# EAGLE design Hermès Phi - Carte BBB v2 (EAGLE 6.3)
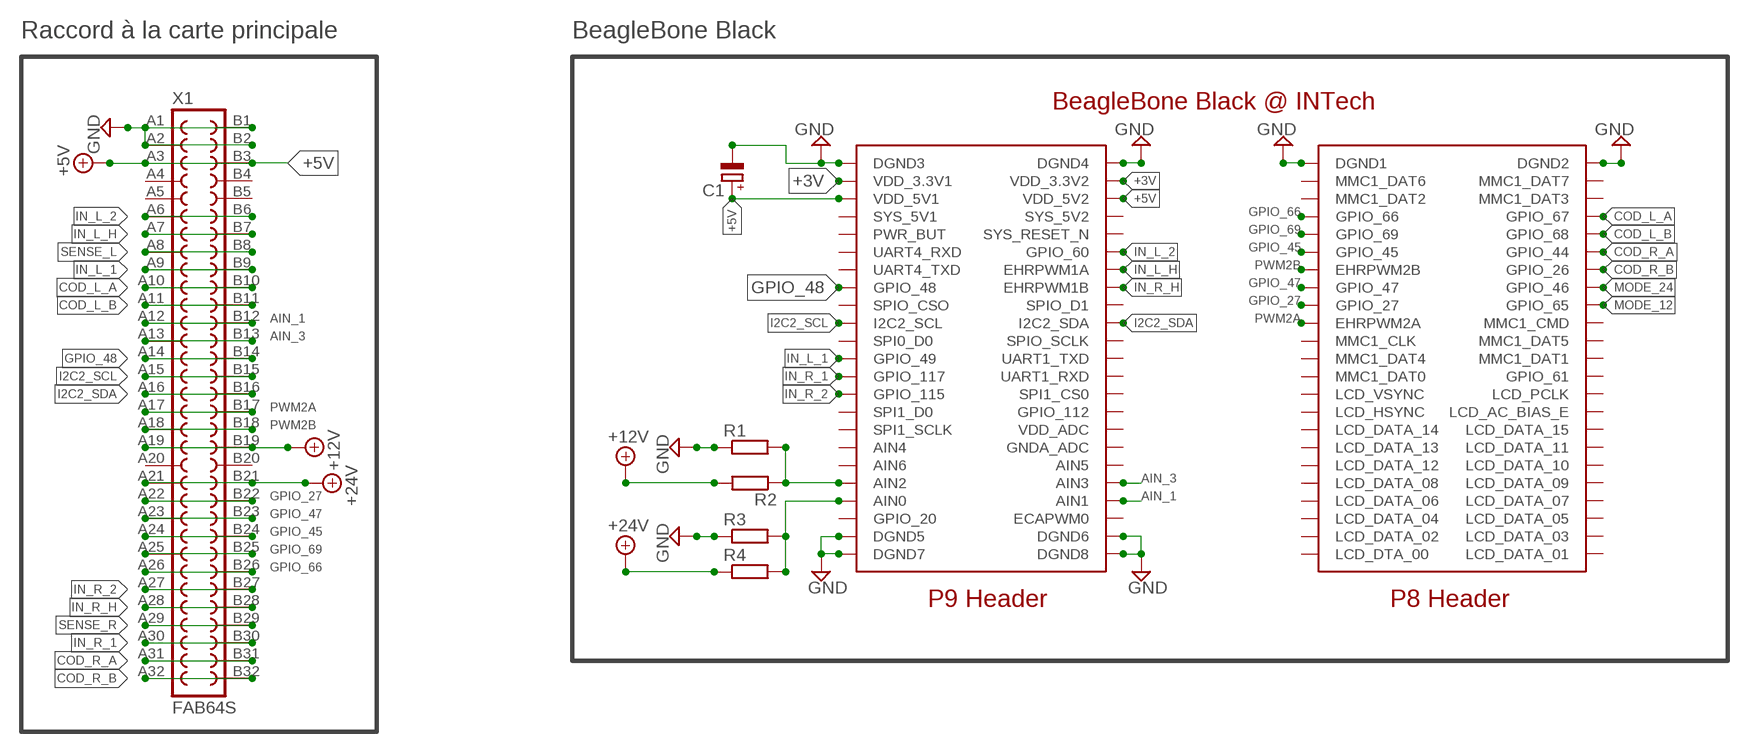
[diagram p0: schematic, sheet 1]

## Parts
C1  CPOL-EUE2.5-5  [E2,5-5]
R1  R-EU_0204/7  [0204/7]
R2  R-EU_0204/7  [0204/7]
R3  R-EU_0204/7  [0204/7]
R4  R-EU_0204/7  [0204/7]
U$1  BBB  [BBB]
X1  FAB64S  [FAB64S]

## Nets
+3V: U$1.VDD_3.3V1 U$1.VDD_3.3V2
+5V: C1.+ U$1.VDD_5V1 U$1.VDD_5V2 X1.A3 X1.B3
+12V: R2.2 X1.A19 X1.B19
+24V: R4.1 X1.A21 X1.B21
AIN_1: U$1.AIN1 X1.A12 X1.B12
AIN_3: U$1.AIN3 X1.A13 X1.B13
COD_L_A: U$1.GPIO_67 X1.A10 X1.B10
COD_L_B: U$1.GPIO_68 X1.A11 X1.B11
COD_R_A: U$1.GPIO_44 X1.A31 X1.B31
COD_R_B: U$1.GPIO_26 X1.A32 X1.B32
GND: C1.- R1.1 R3.1 U$1.DGND1 U$1.DGND2 U$1.DGND3 U$1.DGND4 U$1.DGND5 U$1.DGND6 U$1.DGND7 U$1.DGND8 X1.A1 X1.A2 X1.B1 X1.B2
GPIO_27: U$1.GPIO_27 X1.A22 X1.B22
GPIO_45: U$1.GPIO_45 X1.A24 X1.B24
GPIO_47: U$1.GPIO_47 X1.A23 X1.B23
GPIO_48: U$1.GPIO_48 X1.A14 X1.B14
GPIO_66: U$1.GPIO_66 X1.A26 X1.B26
GPIO_69: U$1.GPIO_69 X1.A25 X1.B25
I2C2_SCL: U$1.I2C2_SCL X1.A15 X1.B15
I2C2_SDA: U$1.I2C_SDA(I2C2_SDA) X1.A16 X1.B16
IN_L_1: U$1.GPIO_49 X1.A9 X1.B9
IN_L_2: U$1.GPIO_60 X1.A6 X1.B6
IN_L_H: U$1.EHRPWM1A X1.A7 X1.B7
IN_R_1: U$1.GPIO_117 X1.A30 X1.B30
IN_R_2: U$1.GPIO_115 X1.A27 X1.B27
IN_R_H: U$1.EHRPWM1B X1.A28 X1.B28
MODE_12: U$1.GPIO_65
MODE_24: U$1.GPIO_46
N$31: R3.2 R4.2 U$1.AIN0
N$32: R1.2 R2.1 U$1.AIN2
PWM2A: U$1.EHRPWM2A X1.A17 X1.B17
PWM2B: U$1.EHRPWMB2(EHRPWM2B) X1.A18 X1.B18
SENSE_L: X1.A8 X1.B8
SENSE_R: X1.A29 X1.B29
Unconnected: U$1.AIN4 U$1.AIN5 U$1.AIN6 U$1.ECAPWM0 U$1.GND_ADC(GNDA_ADC) U$1.GPIO_20 U$1.GPIO_61 U$1.GPIO_112 U$1.LCD_AC_BIAS(LCD_AC_BIAS_E) U$1.LCD_DATA_0(LCD_DTA_00) U$1.LCD_DATA_01 U$1.LCD_DATA_02 U$1.LCD_DATA_04 U$1.LCD_DATA_05 U$1.LCD_DATA_06 U$1.LCD_DATA_07 U$1.LCD_DATA_08 U$1.LCD_DATA_09 U$1.LCD_DATA_10 U$1.LCD_DATA_11 U$1.LCD_DATA_12 U$1.LCD_DATA_13 U$1.LCD_DATA_14 U$1.LCD_DATA_15 U$1.LCD_DTA_03(LCD_DATA_03) U$1.LCD_HSYNC U$1.LCD_PCLK U$1.LCD_VSYNC U$1.MMC1_CLK U$1.MMC1_CMD U$1.MMC1_DAT0 U$1.MMC1_DAT1 U$1.MMC1_DAT2 U$1.MMC1_DAT3 U$1.MMC1_DAT4 U$1.MMC1_DAT5 U$1.MMC1_DAT6 U$1.MMC1_DAT7 U$1.PWR_BUT U$1.SPI1_DO(SPI0_D0) U$1.SPI1_SCLK U$1.SPI1_SCO(SPI1_CS0) U$1.SPIO_CSO U$1.SPIO_D0(SPI1_D0) U$1.SPIO_D1 U$1.SPIO_SCLK U$1.SYS_5V1 U$1.SYS_5V2 U$1.SYS_RESET(SYS_RESET_N) U$1.UART1_RXD U$1.UART1_TXD U$1.UART4_RXD U$1.UART4_TXD U$1.VDD_ADC X1.A4 X1.A5 X1.A20 X1.B4 X1.B5 X1.B20

## Notes on the sheet
- Raccord à la carte principale | BeagleBone Black

## Library data of the parts
C1 = resistor:CPOL-EU: POLARIZED CAPACITOR, European symbol
R1-R4 = resistor:R-EU_: RESISTOR, European symbol
U$1 = BeagleBoneBlack:BBB: BeagleBone Black
X1 = con-vg:FAB64S: CONNECTOR female, 64 pins, block, type B, rows AB, grid 2.54 mm

## Board
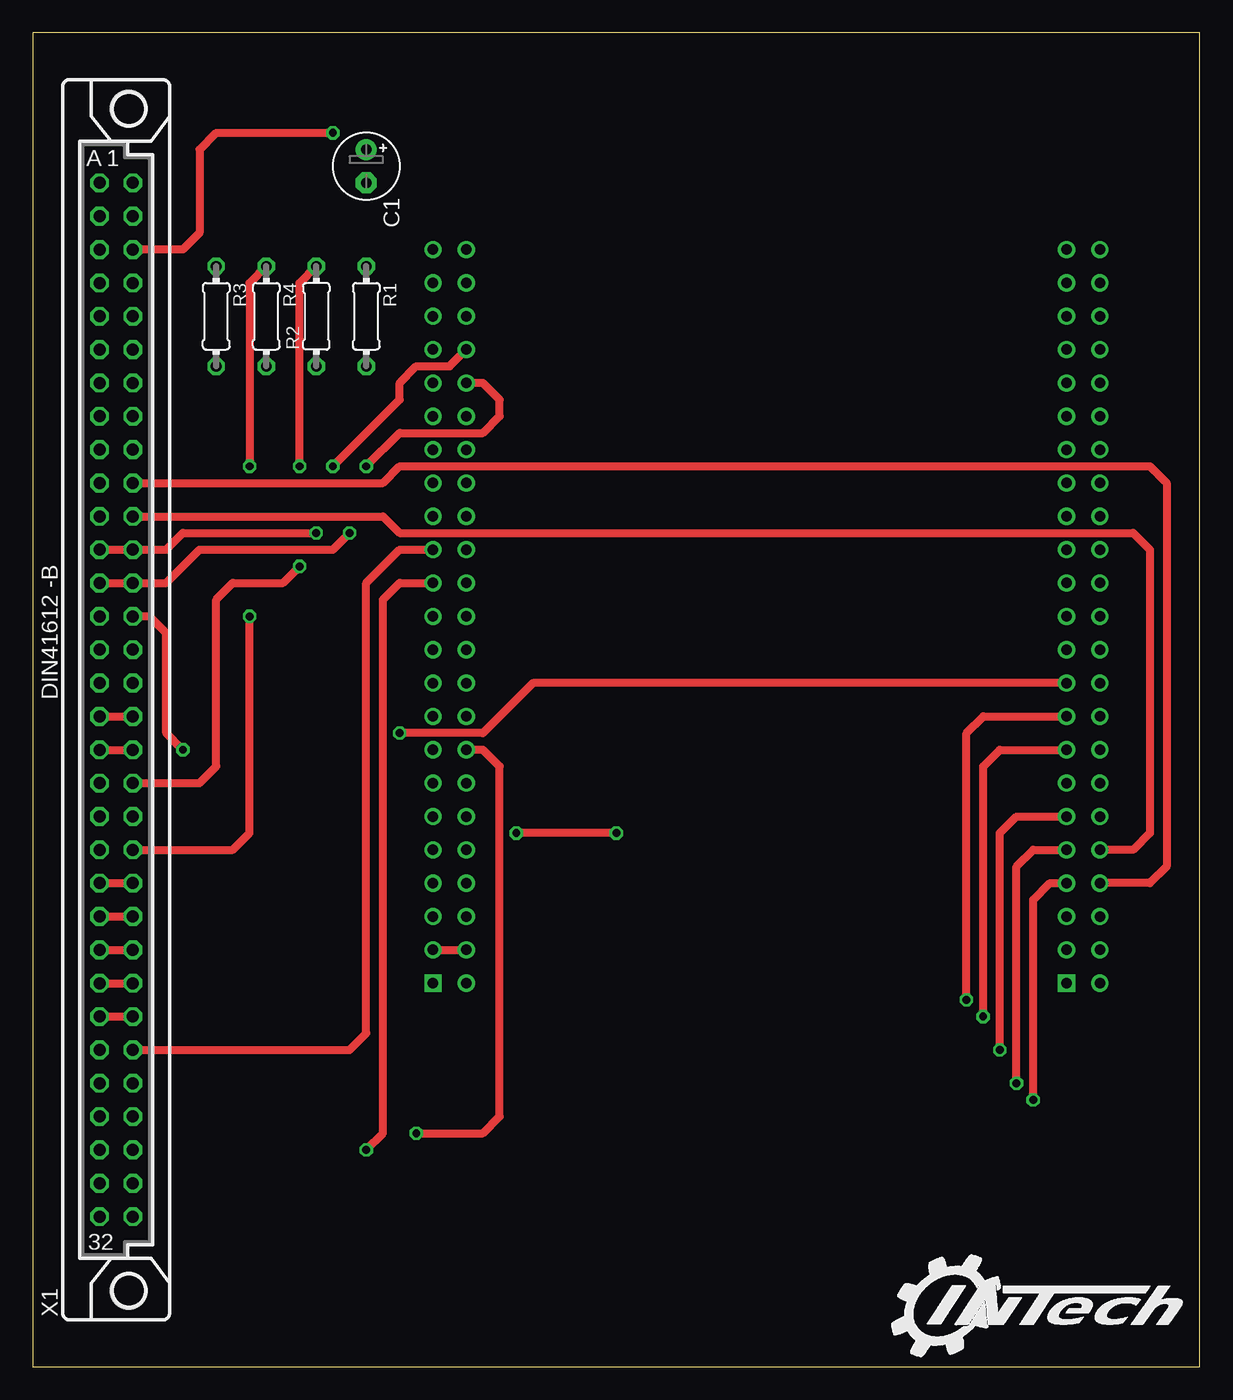
[diagram p1: board, top side]
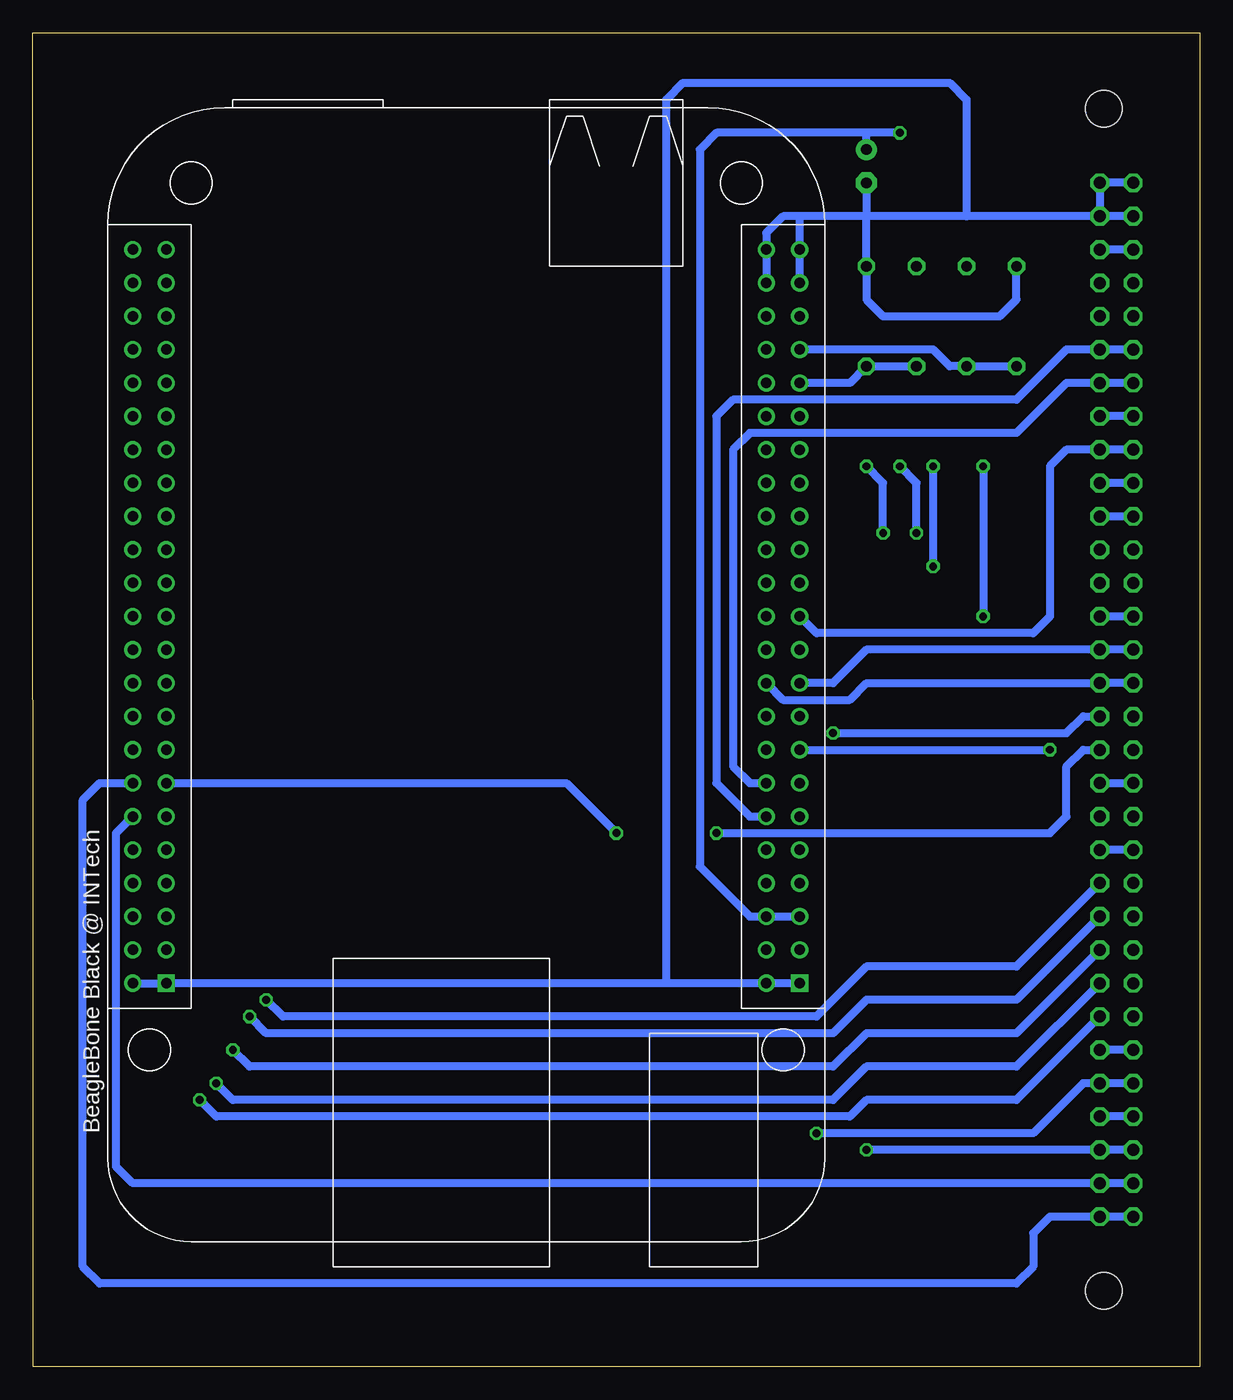
[diagram p2: board, bottom side, seen from below]

Size 88.9 x 101.6 mm. Coordinates in mm from the lower left corner, seen from the top.
Outline: 0,0 88.88,0 88.9,101.6 0,101.6 0,0
Copper layers (1*16): Top 0.035mm / dielectric 1.5mm / Bottom 0.035mm
Design rules "default *": minimum track width 8mil, minimum drill 18mil, track to track 8mil, track to pad 8mil, pad to pad 8mil, via to via 8mil, smd to smd 8mil, copper to edge 8mil, drill to drill 8mil, minimum pad ring 10mil, minimum via ring 8mil, stop-mask expansion 4mil, vias tented up to drill 0mil, thermal gap 10mil

### Footprints (pad centres in the part's own frame; a part is rotated, then mirrored left to right if it is on the bottom)
E2,5-5 = drill 0.813 pad 1.6: + -1.27,0 | drill 0.813 pad 1.6 octagon: - 1.27,0
0204/7 = drill 0.813 octagon: 1 -3.81,0; 2 3.81,0
BBB = drill 0.8: AIN0 66.04,2.54; AIN1 66.04,5.08; AIN2 63.5,2.54; AIN3 63.5,5.08; AIN4 58.42,2.54; AIN5 60.96,5.08; AIN6 60.96,2.54; DGND2 17.78,53.34; DGND4 17.78,5.08; DGND5 71.12,2.54; DGND6 71.12,5.08; DGND7 73.66,2.54; DGND8 73.66,5.08; ECAPWM0 68.58,5.08; EHRPWM1A 33.02,5.08; EHRPWM1B 35.56,5.08; EHRPWM2A 40.64,50.8; EHRPWMB2 33.02,50.8; GND_ADC 58.42,5.08; GPIO_20 68.58,2.54; GPIO_26 33.02,53.34; GPIO_27 38.1,50.8; GPIO_44 30.48,53.34; GPIO_45 30.48,50.8; GPIO_46 35.56,53.34; GPIO_47 35.56,50.8; GPIO_48 35.56,2.54; GPIO_49 45.72,2.54; GPIO_60 30.48,5.08; GPIO_61 48.26,53.34; GPIO_65 38.1,53.34; GPIO_66 25.4,50.8; GPIO_67 25.4,53.34; GPIO_68 27.94,53.34; GPIO_69 27.94,50.8; GPIO_112 53.34,5.08; GPIO_115 50.8,2.54; GPIO_117 48.26,2.54; I2C2_SCL 40.64,2.54; I2C_SDA 40.64,5.08; LCD_AC_BIAS 53.34,53.34; LCD_DATA_0 73.66,50.8; LCD_DATA_01 73.66,53.34; LCD_DATA_02 71.12,50.8; LCD_DATA_04 68.58,50.8; LCD_DATA_05 68.58,53.34; LCD_DATA_06 66.04,50.8; LCD_DATA_07 66.04,53.34; LCD_DATA_08 63.5,50.8; LCD_DATA_09 63.5,53.34; LCD_DATA_10 60.96,53.34; LCD_DATA_11 58.42,53.34; LCD_DATA_12 60.96,50.8; LCD_DATA_13 58.42,50.8; LCD_DATA_14 55.88,50.8; LCD_DATA_15 55.88,53.34; LCD_DTA_03 71.12,53.34; LCD_HSYNC 53.34,50.8; LCD_PCLK 50.8,53.34; LCD_VSYNC 50.8,50.8; MMC1_CLK 43.18,50.8; MMC1_CMD 40.64,53.34; MMC1_DAT0 48.26,50.8; MMC1_DAT1 45.72,53.34; MMC1_DAT2 22.86,50.8; MMC1_DAT3 22.86,53.34; MMC1_DAT4 45.72,50.8; MMC1_DAT5 43.18,53.34; MMC1_DAT6 20.32,50.8; MMC1_DAT7 20.32,53.34; PWR_BUT 27.94,2.54; SPI1_DO 53.34,2.54; SPI1_SCLK 55.88,2.54; SPI1_SCO 50.8,5.08; SPIO_CSO 38.1,2.54; SPIO_D0 43.18,2.54; SPIO_D1 38.1,5.08; SPIO_SCLK 43.18,5.08; SYS_5V1 25.4,2.54; SYS_5V2 25.4,5.08; SYS_RESET 27.94,5.08; UART1_RXD 48.26,5.08; UART1_TXD 45.72,5.08; UART4_RXD 30.48,2.54; UART4_TXD 33.02,2.54; VDD_3.3V1 20.32,2.54; VDD_3.3V2 20.32,5.08; VDD_5V1 22.86,2.54; VDD_5V2 22.86,5.08; VDD_ADC 55.88,5.08 | drill 0.8 square: DGND1 17.78,50.8; DGND3 17.78,2.54
FAB64S = drill 0.914 octagon: A1 -1.27,39.37; A2 -1.27,36.83; A3 -1.27,34.29; A4 -1.27,31.75; A5 -1.27,29.21; A6 -1.27,26.67; A7 -1.27,24.13; A8 -1.27,21.59; A9 -1.27,19.05; A10 -1.27,16.51; A11 -1.27,13.97; A12 -1.27,11.43; A13 -1.27,8.89; A14 -1.27,6.35; A15 -1.27,3.81; A16 -1.27,1.27; A17 -1.27,-1.27; A18 -1.27,-3.81; A19 -1.27,-6.35; A20 -1.27,-8.89; A21 -1.27,-11.43; A22 -1.27,-13.97; A23 -1.27,-16.51; A24 -1.27,-19.05; A25 -1.27,-21.59; A26 -1.27,-24.13; A27 -1.27,-26.67; A28 -1.27,-29.21; A29 -1.27,-31.75; A30 -1.27,-34.29; A31 -1.27,-36.83; A32 -1.27,-39.37; B1 1.27,39.37; B2 1.27,36.83; B3 1.27,34.29; B4 1.27,31.75; B5 1.27,29.21; B6 1.27,26.67; B7 1.27,24.13; B8 1.27,21.59; B9 1.27,19.05; B10 1.27,16.51; B11 1.27,13.97; B12 1.27,11.43; B13 1.27,8.89; B14 1.27,6.35; B15 1.27,3.81; B16 1.27,1.27; B17 1.27,-1.27; B18 1.27,-3.81; B19 1.27,-6.35; B20 1.27,-8.89; B21 1.27,-11.43; B22 1.27,-13.97; B23 1.27,-16.51; B24 1.27,-19.05; B25 1.27,-21.59; B26 1.27,-24.13; B27 1.27,-26.67; B28 1.27,-29.21; B29 1.27,-31.75; B30 1.27,-34.29; B31 1.27,-36.83; B32 1.27,-39.37 | hole 2.794: 0.965,-45.009; 0.965,45.009

### Placement (x,y rotation side)
C1  25.4,91.44 270 top
R1  25.4,80.01 270 top
R2  21.59,80.01 90 top
R3  13.97,80.01 270 top
R4  17.78,80.01 270 top
U$1  27.94,11.43 90 bottom
X1  6.35,50.8 0 top

### Tracks (layer width: path | path; a pad name or v marks a point on that pad's centre or on a via)
+3V
  Top 0.61: U$1.VDD_3.3V1 U$1.VDD_3.3V2
+5V  (via drill 0.6)
  Top 0.61: X1.B3 11.43,85.09 12.7,86.36 12.7,92.71 13.97,93.98 v22.86,93.98
  Bottom 0.61: X1.A3 X1.B3 | 25.4,93.98 36.83,93.98 38.1,92.71 38.1,38.1 34.29,34.29 U$1.VDD_5V2 U$1.VDD_5V1 | C1.+ 25.4,93.98 | v22.86,93.98 25.4,93.98
+12V  (via drill 0.6)
  Top 0.61: X1.B19 12.7,44.45 13.97,45.72 13.97,58.42 15.24,59.69 19.05,59.69 v20.32,60.96 | v20.32,68.58 20.32,82.55 R2.2
  Bottom 0.61: X1.B19 X1.A19 | v20.32,60.96 v20.32,68.58
+24V  (via drill 0.6)
  Top 0.61: R4.1 16.51,82.55 v16.51,68.58 | X1.B21 15.24,39.37 16.51,40.64 v16.51,57.15
  Bottom 0.61: X1.A21 X1.B21 | v16.51,68.58 v16.51,57.15
AIN_1  (via drill 0.6)
  Top 0.61: X1.A12 X1.B12 10.16,62.23 11.43,63.5 v21.59,63.5 | U$1.AIN1 31.75,76.2 29.21,76.2 27.94,74.93 27.94,73.66 v22.86,68.58
  Bottom 0.61: v21.59,63.5 21.59,67.31 v22.86,68.58
AIN_3  (via drill 0.6)
  Top 0.61: X1.A13 X1.B13 10.16,59.69 12.7,62.23 22.86,62.23 v24.13,63.5 | v25.4,68.58 27.94,71.12 34.29,71.12 35.56,72.39 35.56,73.66 34.29,74.93 U$1.AIN3
  Bottom 0.61: v24.13,63.5 24.13,67.31 v25.4,68.58
COD_L_A
  Top 0.61: X1.B10 26.67,67.31 27.94,68.58 85.09,68.58 86.36,67.31 86.36,38.1 85.09,36.83 U$1.GPIO_67
  Bottom 0.61: X1.A10 X1.B10
COD_L_B
  Top 0.61: X1.B11 26.67,64.77 27.94,63.5 83.82,63.5 85.09,62.23 85.09,40.64 83.82,39.37 U$1.GPIO_68
  Bottom 0.61: X1.A11 X1.B11
COD_R_A
  Bottom 0.61: X1.A31 X1.B31 81.28,13.97 82.55,15.24 82.55,40.64 U$1.GPIO_44
COD_R_B
  Bottom 0.61: X1.A32 X1.B32 11.43,11.43 12.7,10.16 12.7,7.62 13.97,6.35 83.82,6.35 85.09,7.62 85.09,43.18 83.82,44.45 U$1.GPIO_26
GND
  Bottom 0.61: X1.A1 X1.B1 X1.B2 | X1.A2 X1.B2 | U$1.DGND2 U$1.DGND1 40.64,29.21 | U$1.DGND3 U$1.DGND4 40.64,29.21 | X1.B2 17.78,87.63 | 17.78,87.63 25.4,87.63 | 25.4,87.63 30.48,87.63 | U$1.DGND6 U$1.DGND8 33.02,86.36 31.75,87.63 30.48,87.63 | 30.48,87.63 U$1.DGND7 U$1.DGND5 | 40.64,29.21 40.64,96.52 39.37,97.79 19.05,97.79 17.78,96.52 17.78,87.63 | C1.- 25.4,87.63 | R3.1 13.97,81.28 15.24,80.01 24.13,80.01 25.4,81.28 R1.1 25.4,87.63
GPIO_27  (via drill 0.6)
  Top 0.61: X1.A22 X1.B22 | v71.12,27.94 71.12,48.26 72.39,49.53 U$1.GPIO_27
  Bottom 0.61: X1.B22 13.97,30.48 25.4,30.48 29.21,26.67 69.85,26.67 v71.12,27.94
GPIO_45  (via drill 0.6)
  Top 0.61: X1.A24 X1.B24 | v73.66,24.13 73.66,40.64 74.93,41.91 U$1.GPIO_45
  Bottom 0.61: X1.B24 13.97,25.4 25.4,25.4 27.94,22.86 72.39,22.86 v73.66,24.13
GPIO_47  (via drill 0.6)
  Top 0.61: X1.A23 X1.B23 | v72.39,26.67 72.39,45.72 73.66,46.99 U$1.GPIO_47
  Bottom 0.61: X1.B23 13.97,27.94 25.4,27.94 27.94,25.4 71.12,25.4 v72.39,26.67
GPIO_48  (via drill 0.6)
  Top 0.61: v11.43,46.99 10.16,48.26 10.16,55.88 8.89,57.15 X1.B14
  Bottom 0.61: X1.A14 X1.B14 | U$1.GPIO_48 v11.43,46.99
GPIO_66  (via drill 0.6)
  Top 0.61: X1.A26 X1.B26 | v76.2,20.32 76.2,35.56 77.47,36.83 U$1.GPIO_66
  Bottom 0.61: X1.B26 13.97,20.32 25.4,20.32 26.67,19.05 74.93,19.05 v76.2,20.32
GPIO_69  (via drill 0.6)
  Top 0.61: X1.A25 X1.B25 | v74.93,21.59 74.93,38.1 76.2,39.37 U$1.GPIO_69
  Bottom 0.61: X1.B25 13.97,22.86 25.4,22.86 27.94,20.32 73.66,20.32 v74.93,21.59
I2C2_SCL
  Bottom 0.61: X1.A15 X1.B15 25.4,54.61 27.94,52.07 U$1.I2C2_SCL
I2C2_SDA
  Bottom 0.61: X1.A16 X1.B16 25.4,52.07 26.67,50.8 31.75,50.8 U$1.I2C_SDA
IN_L_1
  Bottom 0.61: X1.A9 X1.B9 10.16,69.85 11.43,68.58 11.43,57.15 12.7,55.88 29.21,55.88 U$1.GPIO_49
IN_L_2
  Bottom 0.61: X1.A6 X1.B6 10.16,77.47 13.97,73.66 35.56,73.66 36.83,72.39 36.83,44.45 34.29,41.91 U$1.GPIO_60
IN_L_H
  Bottom 0.61: X1.A7 X1.B7 10.16,74.93 13.97,71.12 34.29,71.12 35.56,69.85 35.56,45.72 34.29,44.45 U$1.EHRPWM1A
IN_R_1  (via drill 0.6)
  Top 0.61: v25.4,16.51 26.67,17.78 26.67,58.42 27.94,59.69 U$1.GPIO_117
  Bottom 0.61: X1.A30 X1.B30 v25.4,16.51
IN_R_2
  Top 0.61: X1.B27 24.13,24.13 25.4,25.4 25.4,59.69 27.94,62.23 U$1.GPIO_115
  Bottom 0.61: X1.A27 X1.B27
IN_R_H  (via drill 0.6)
  Top 0.61: v29.21,17.78 34.29,17.78 35.56,19.05 35.56,45.72 34.29,46.99 U$1.EHRPWM1B
  Bottom 0.61: X1.A28 X1.B28 8.89,21.59 12.7,17.78 v29.21,17.78
N$31
  Bottom 0.61: R3.2 R4.2 19.05,76.2 20.32,77.47 U$1.AIN0
N$32
  Bottom 0.61: R2.1 R1.2 26.67,74.93 U$1.AIN2
PWM2A  (via drill 0.6)
  Top 0.61: X1.A17 X1.B17 | U$1.EHRPWM2A 38.1,52.07 34.29,48.26 v27.94,48.26
  Bottom 0.61: v27.94,48.26 10.16,48.26 8.89,49.53 X1.B17
PWM2B  (via drill 0.6)
  Top 0.61: X1.A18 X1.B18 | v44.45,40.64 v36.83,40.64
  Bottom 0.61: U$1.EHRPWMB2 48.26,44.45 v44.45,40.64 | v36.83,40.64 11.43,40.64 10.16,41.91 10.16,45.72 8.89,46.99 X1.B18
SENSE_L
  Bottom 0.61: X1.A8 X1.B8
SENSE_R
  Bottom 0.61: X1.A29 X1.B29

### Text on the board
Sérigraphie: Micro SD | A1 | P9 | P8 | C1 | GND | GND | AIN_0 | AIN_2 | R3 | R4 | R2 | R1 | INR_2 | INR_1 | INL_1 | I2C SCL - SDA | IRGPIO - INR_H | INL_H | COD_R_B | INL_2 | COD_R_A | COD_L_B | COD_L_A | 5V | 3V3 | GND | GND | A1. GND / A2. GND / A3. 5V / A6. ING_2 / A7. ING_H / A8. SENSE_G / A9. ING_1 / A10. COD_G_A / A11. COD_G_B / A14. IR GPIO / A15. I2C_SCL / A16. I2C_SDA / A19. +12V / A21. +24V / A27. IND_2 / A28. IND_H / A29. SENSE_D / A30. IND_1 / A31. COD_D_A / A32. COD_D_B | A32 | HERMES PHI / BEAGLEBONE BLACK